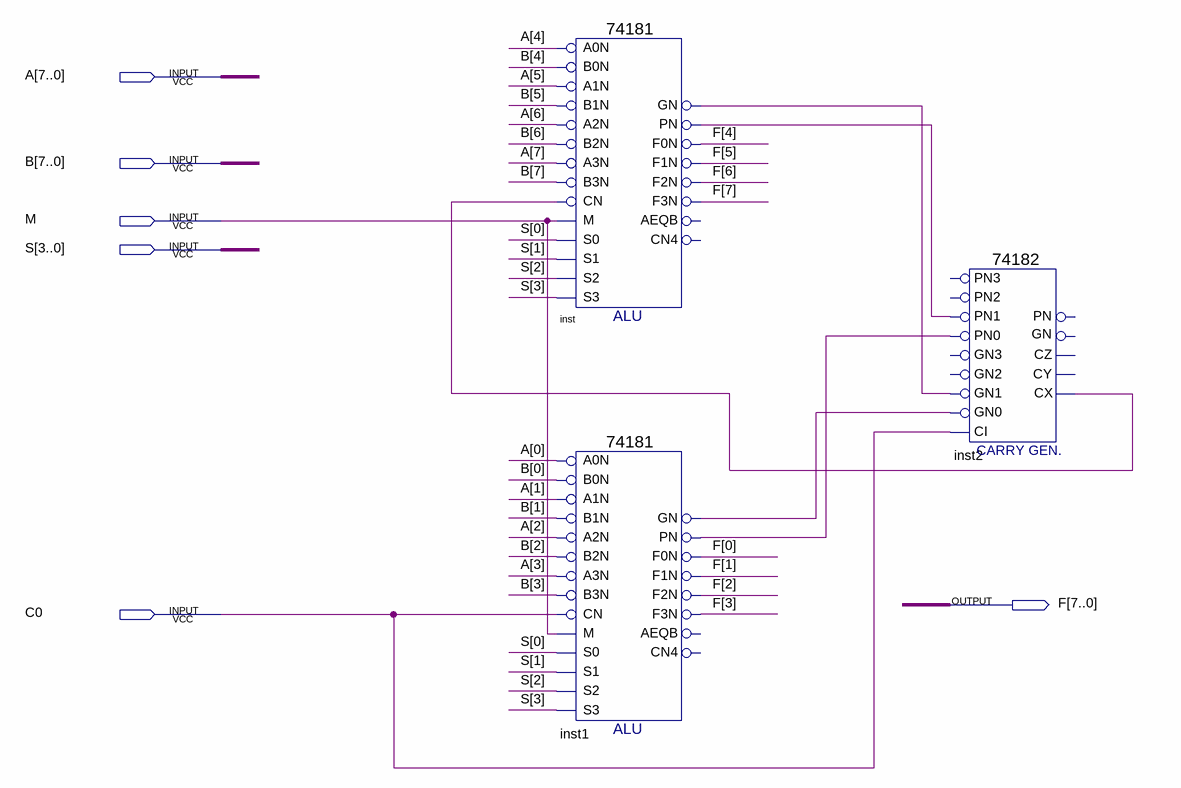
[diagram p0: schematic sheet]
// Quartus schematic 8_Bit_ALU.bdf as structural Verilog: 3 symbols, 6 pins
module \8_Bit_ALU  (
  input  [7:0] A,
  input  [7:0] B,
  input  M,
  input  [3:0] S,
  input  C0,
  output [7:0] F
);

  wire inst1_gn, inst1_pn, inst2_cx, inst_gn, inst_pn;

  \74181  inst (
    .B0N(B[4]), .A0N(A[4]), .A1N(A[5]), .B1N(B[5]), .A3N(A[7]), .B2N(B[6]), .A2N(A[6]), .M(M), .CN(inst2_cx),
    .B3N(B[7]), .S2(S[2]), .S1(S[1]), .S0(S[0]), .S3(S[3]), .PN(inst_pn), .GN(inst_gn), .F3N(F[7]),
    .F1N(F[5]), .F0N(F[4]), .F2N(F[6]));  // open: AEQB, CN4
  \74181  inst1 (
    .B0N(B[0]), .A0N(A[0]), .A1N(A[1]), .B1N(B[1]), .A3N(A[3]), .B2N(B[2]), .A2N(A[2]), .M(M), .CN(C0),
    .B3N(B[3]), .S2(S[2]), .S1(S[1]), .S0(S[0]), .S3(S[3]), .PN(inst1_pn), .GN(inst1_gn), .F3N(F[3]),
    .F1N(F[1]), .F0N(F[0]), .F2N(F[2]));  // open: AEQB, CN4
  \74182  inst2 (
    .CI(C0), .PN1(inst_pn), .PN0(inst1_pn), .GN1(inst_gn), .GN0(inst1_gn), .CX(inst2_cx));  // open: PN2, GN2, GN3, PN3, CY, PN, CZ, GN
endmodule
